# EAGLE design Mind-Synchronizing-Generator-PinHdrPotX-perf (EAGLE 7.2.0)
Analoger Wellenmustergenerator mit 3 (trippel-Fünf) 555 Timer.
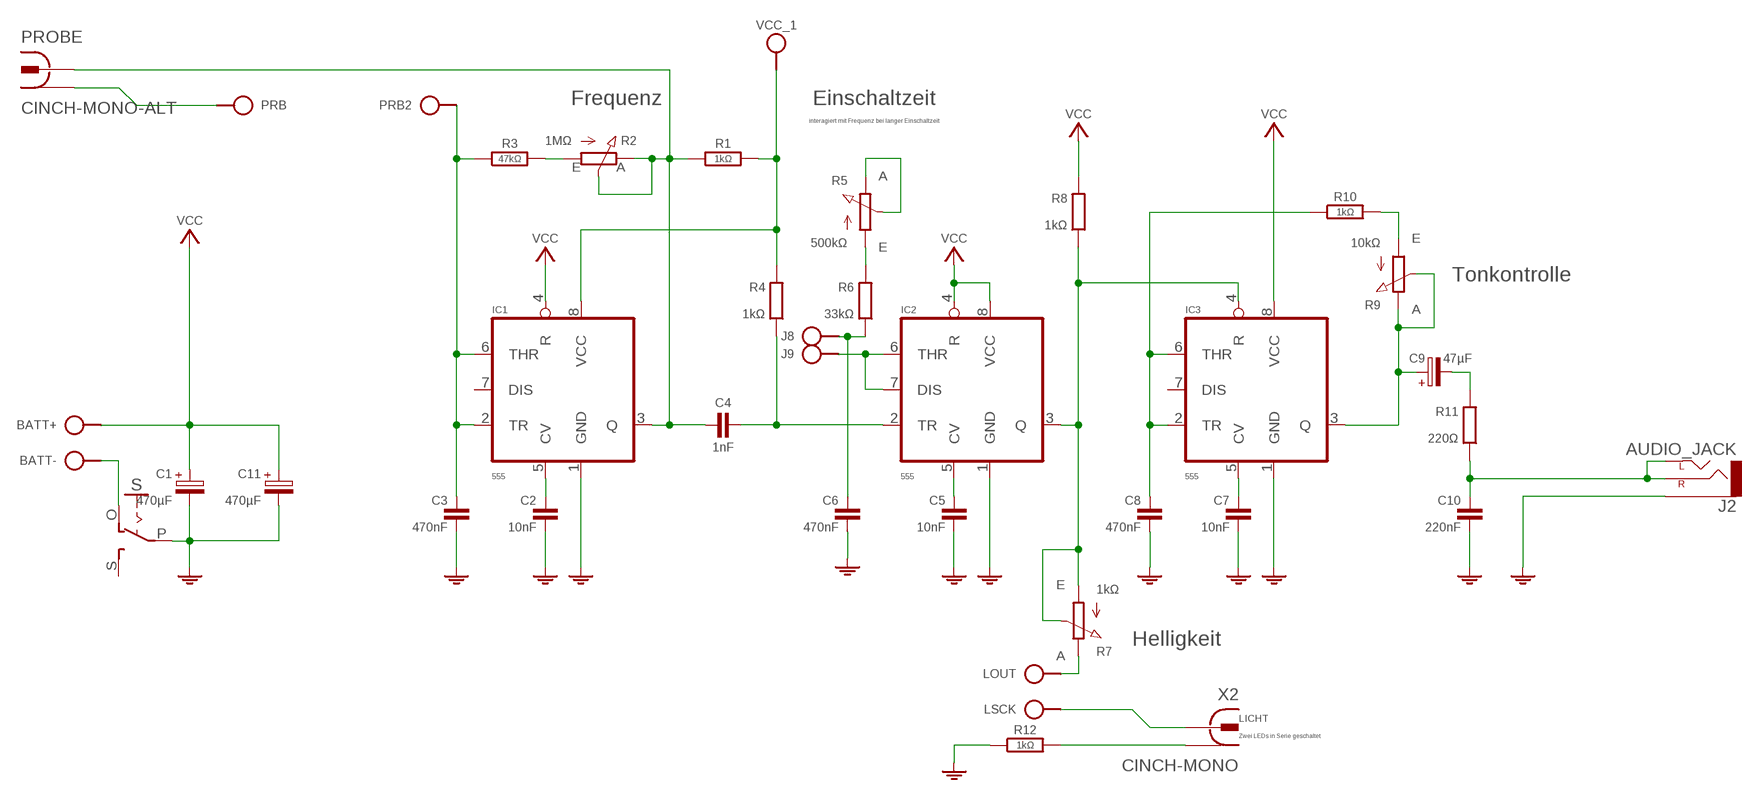
[diagram p0: schematic, sheet 1]

## Parts
BATT  SPAD+--+  [SPAD-+]
C1  470µF  CPOLE2.5-6  [E2,5-6]
C2  10nF  C050-020X044  [C050-020X044]
C3  470nF  C050-040X075  [C050-040X075]
C4  1nF  C-H050-020X044  [C050-020X044]
C5  10nF  C050-020X044/V  [C050-020X044/V]
C6  470nF  C050-040X075  [C050-040X075]
C7  10nF  C050-020X044/V  [C050-020X044/V]
C8  470nF  C050-040X075  [C050-040X075]
C9  47µF  CPOL-HE2,5-4  [E2,5-4]
C10  220nF  C025-025X060  [C050-025X060]
C11  470µF  CPOLE2.5-6  [E2,5-6]
IC1  555  555_ALT2-LBL  [555-DIL]
IC2  555  555_ALT2-LBL  [555-DIL]
IC3  555  555_ALT2-LBL  [555-DIL]
J2  AUDIO_JACK  [AUDIO-JACK]
J8  HPORT  [SPAD]
J9  HPORT  [SPAD]
LOUT  HPORT  [SPAD]
LSCK  HPORT  [SPAD]
PRB  HPORT  [SPAD]
PRB2  HPORT  [SPAD]
PROBE  CINCH-MONO-ALT  [736880-49]
R1  1kΩ  R-H0204/10  [0204/10]
R2  1MΩ  POT-H-3P  [CONN-3P]
R3  47kΩ  R-H0204/10  [0204/10]
R4  1kΩ  R0204/10-V  [0204/10-V]
R5  500kΩ  POT-3P  [CONN-3P]
R6  33kΩ  R0204/10  [0204/10]
R7  1kΩ  POT-3P-S1  [CONN-3P]
R8  1kΩ  R0204/10-V  [0204/10-V]
R9  10kΩ  POT-3P  [CONN-3P]
R10  1kΩ  R-H0204/10  [0204/10]
R11  220Ω  R0204/10-V  [0204/10-V]
R12  1kΩ  R-H0204/10  [0204/10]
S  SL-SW-1P-2T-H  [SLSW-1P2T-H]
VCC_1  VPORT  [SPAD]
X2  CINCH-MONO  [736880-49]

## Nets
GND: C1.- C2.2 C3.2 C5.2 C6.2 C7.2 C8.2 C10.2 C11.- IC1.1(GND) IC2.1(GND) IC3.1(GND) J2.SLEEVE R12.1 S.P
LED_A1: LOUT.1 R7.3(E)
LED_K: R12.2 X2.1
N$1: C5.1 IC2.5(CV)
N$2: BATT.1 S.O
N$4: LSCK.1 X2.1@1
N$5: C6.1 J8.1 R6.2
N$7: C2.1 IC1.5(CV)
N$8: R5.1(A) R6.1
N$10: R9.1(A) R10.2
N$11: R2.1(A) R3.2
N$15: C9.- R11.1
N$16: C10.1 J2.RING(RIGHT) J2.TIP(LEFT) R11.2
N$17: C7.1 IC3.5(CV)
PRB2: PRB.1 PROBE.1
Q1: C4.1 IC1.3(Q) PROBE.1@2 R1.1 R2.2(S) R2.3(E)
Q2: IC2.3(Q) IC3.4(R) R7.1(S) R7.2(A) R8.2
Q3: C9.+ IC3.3(Q) R9.2(S) R9.3(E)
TH2: IC2.6(THR) IC2.7(DIS) J9.1
TR1: C3.1 IC1.2(TR) IC1.6(THR) PRB2.1 R3.1
TR2: C4.2 IC2.2(TR) R4.2
TR3: C8.1 IC3.2(TR) IC3.6(THR) R10.1
VCC: BATT.2 C1.+ C11.+ IC1.4(R) IC2.4(R) IC2.8(VCC) IC3.8(VCC) R5.2(S) R5.3(E) R8.1
VCC_1: IC1.8(VCC) R1.2 R4.1 VCC_1.1
Unconnected: IC1.7(DIS) IC3.7(DIS) S.S

## Notes on the sheet
- Frequenz | Einschaltzeit
- interagiert mit Frequenz bei langer Einschaltzeit
- Tonkontrolle
- Helligkeit
- LICHT
- Zwei LEDs in Serie geschaltet

## Library data of the parts
BATT = pad:SPAD+-
C1 C11 = c:CPOL: POLARIZED CAPACITOR, European symbol
C2 C3 C5-C8 C10 = c:C: CAPACITOR, European symbol
C4 = c:C-H
C9 = c:CPOL-H
IC1-IC3 = ic:*555_ALT2
J2 = pad:AUDIO_JACK
J8 J9 LOUT LSCK PRB PRB2 = pad:HPORT
PROBE X2 = pad:CINCH-MONO: Lumberg Connectors include con-mfs.lbr - 2001.03.22 Jack connectors - 2005.11.23 http://www.lumberg.de Created by librarian@cadsoft.de
R1 R3 R10 R12 = r:R-H
R2 = r:POT-H
R4 R6 R8 R11 = r:R: RESISTOR, European symbol
R5 R7 R9 = r:POT
S = sw:SL-SW-1P-2T
VCC_1 = pad:VPORT

## Board
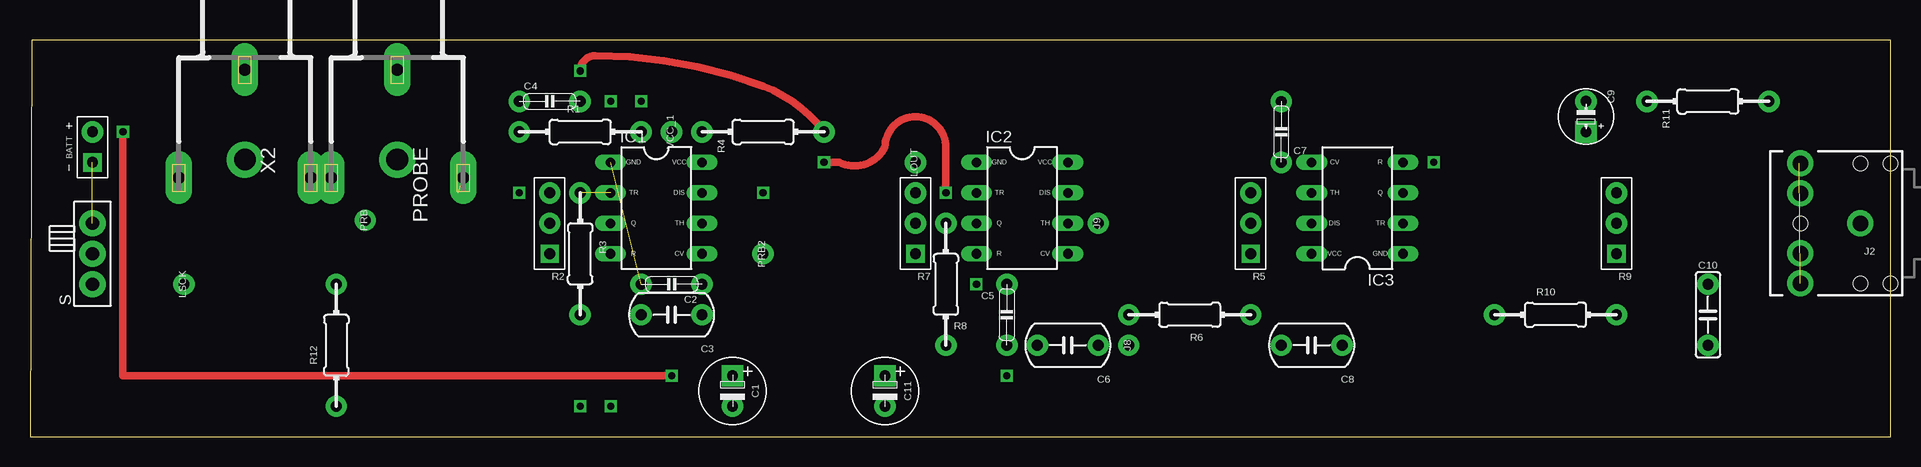
[diagram p1: board, top side]
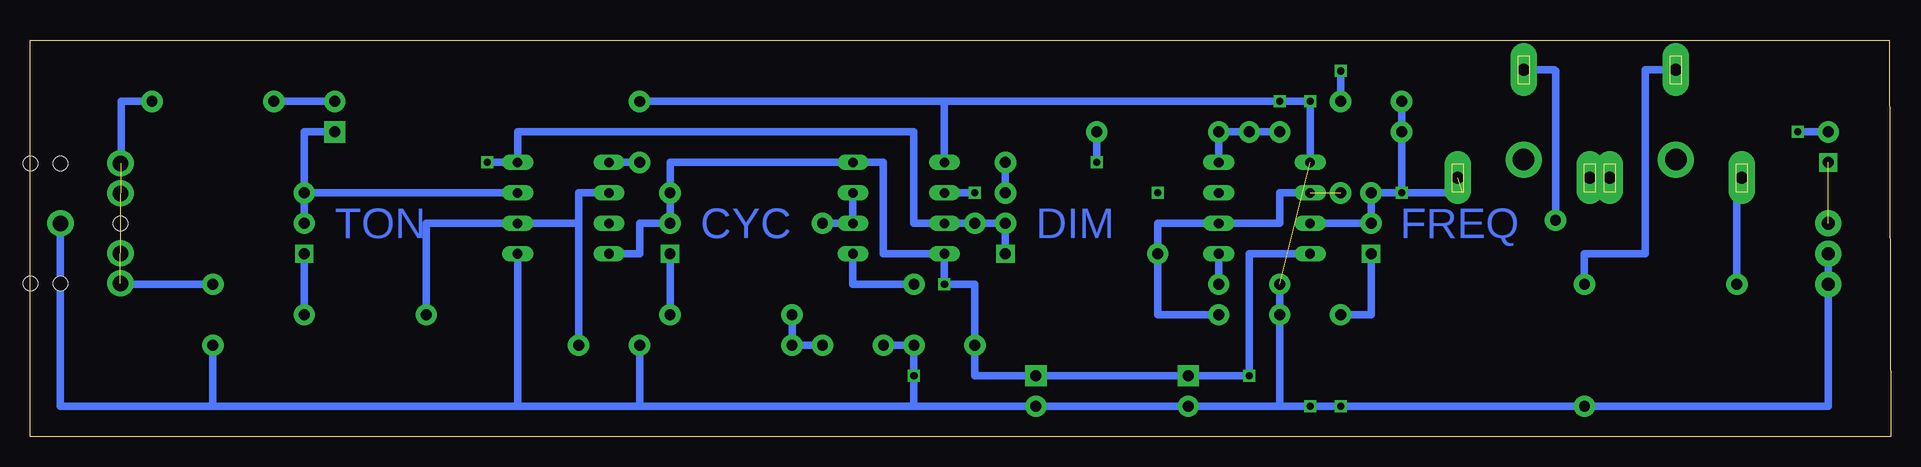
[diagram p2: board, bottom side, seen from below]

Size 155.07 x 33.02 mm. Coordinates in mm from the lower left corner, seen from the top.
Outline: 0,0 155.07,0 155.07,33.02 0.13,33.02 0,0
Copper layers (1*16): Top 0.035mm / dielectric 1.5mm / Bottom 0.035mm
Design rules "default": minimum track width 10mil, minimum drill 24mil, track to track 8mil, track to pad 8mil, pad to pad 8mil, via to via 8mil, smd to smd 8mil, copper to edge 40mil, drill to drill 8mil, minimum pad ring 10mil, minimum via ring 8mil, stop-mask expansion 4mil, vias tented up to drill 0mil, thermal gap 10mil

### Footprints (pad centres in the part's own frame; a part is rotated, then mirrored left to right if it is on the bottom)
SPAD-+ = drill 0.9 pad 1.524 square: 1 0,-1.27 | drill 0.9 pad 1.778: 2 0,1.27
E2,5-6 = drill 0.9 pad 1.778 square: + -1.27,0 | drill 0.9 pad 1.778: - 1.27,0
C050-020X044 = drill 0.9 pad 1.778: 1 -2.54,0; 2 2.54,0
C050-040X075 = drill 0.9 pad 1.778: 1 -2.54,0; 2 2.54,0
C050-020X044/V = drill 0.9 pad 1.778: 1 0,2.54; 2 0,-2.54
E2,5-4 = drill 0.9 pad 1.778 square: + 1.27,0 | drill 0.9 pad 1.778: - -1.27,0
C050-025X060 = drill 0.9 pad 1.778: 1 0,2.54; 2 0,-2.54
555-DIL = drill 0.8 pad 1.27 long: 1 -3.81,3.81; 2 -3.81,1.27; 3 -3.81,-1.27; 4 -3.81,-3.81; 5 3.81,-3.81; 6 3.81,-1.27; 7 3.81,1.27; 8 3.81,3.81
AUDIO-JACK = drill 1.3 pad 2.184: RING 5,5; RSH 5,2.5; SLEEVE 0,0; TIP 5,-5; TSH 5,-2.5 | hole 1.2: 0,5; -2.5,5; -2.5,-5; 0,-5; 5,0
SPAD = drill 0.9 pad 1.778: 1 0,0
736880-49 = drill 1 pad 2.2 long: 1 -3.92,0; 1@1 5.08,-5.5; 1@2 5.08,5.5 | drill 1.8 pad 3: 2 3.58,0
0204/10 = drill 0.9 pad 1.778: 1 -5.08,0; 2 5.08,0
CONN-3P = drill 0.9 pad 1.524 square: 1 0,2.54 | drill 0.9 pad 1.778: 2 0,0; 3 0,-2.54
0204/10-V = drill 0.9 pad 1.778: 1 0,5.08; 2 0,-5.08
SLSW-1P2T-H = drill 1.1 pad 2.184: O 2.54,0; P 0,0; S -2.54,0

### Placement (x,y rotation side)
BATT  5.21,24.13 0 top
C1  58.55,3.81 270 top
C2  53.47,12.7 180 top
C3  53.47,10.16 180 top
C4  43.31,27.94 0 top
C5  81.41,10.16 0 top
C6  86.49,7.62 180 top
C7  104.27,25.4 180 top
C8  106.81,7.62 180 top
C9  129.67,26.67 270 top
C10  139.83,10.16 0 top
C11  71.25,3.81 270 top
IC1  52.2,19.05 0 top
IC2  82.68,19.05 0 top
IC3  110.62,19.05 180 top
J2  152.53,17.78 180 top
J8  91.57,7.62 0 top
J9  89.03,17.78 0 top
LOUT  73.79,22.86 0 top
LSCK  12.83,12.7 0 top
PRB  27.94,18.03 0 top
PRB2  61.09,15.24 0 top
PROBE  30.61,26.67 270 top
R1  45.85,25.4 0 top
R2  43.31,17.78 180 top
R3  45.85,15.24 270 top
R4  61.09,25.4 90 top
R5  101.73,17.78 180 top
R6  96.65,10.16 180 top
R7  73.79,17.78 180 top
R8  76.33,12.7 180 top
R9  132.21,17.78 180 top
R10  127.13,10.16 0 top
R11  139.83,27.94 90 top
R12  25.53,7.62 90 top
S  5.21,15.24 90 top
VCC_1  53.47,25.4 0 top
X2  17.91,26.67 270 top

### Tracks (layer width: path | path; a pad name or v marks a point on that pad's centre or on a via)
GND  (via drill 0.6)  (1 unrouted)
  Bottom 0.61: C6.2 C5.2 v81.41,5.08 81.41,2.54 | 81.41,2.54 C11.- C1.- | C1.- v48.39,2.54 v45.85,2.54 R12.1 5.21,2.54 S.P | 78.87,27.94 C7.2 | IC2.1 78.87,27.94 | 78.87,27.94 v50.93,27.94 v48.39,27.94 IC1.1 | 104.27,2.54 81.41,2.54 | C8.2 104.27,2.54 | 104.27,2.54 114.43,2.54 | 114.43,2.54 IC3.1 | C2.2 C3.2 50.93,2.54 C1.- | 114.43,2.54 139.83,2.54 | 139.83,2.54 152.53,2.54 J2.SLEEVE | C10.2 139.83,2.54
LED_A1
  Bottom 0.61: R7.3 LOUT.1
LED_K
  Bottom 0.61: R12.2 25.53,15.24 20.45,15.24 20.45,30.59 X2.1
N$1
  Bottom 0.61: C5.1 86.49,12.7 IC2.5
N$2  (1 unrouted)
N$3  (via drill 0.6)
  other vias: 61.09,20.32
N$4
  Bottom 0.61: LSCK.1 12.83,21.59 X2.1@1
N$5
  Bottom 0.61: C6.1 J8.1 R6.2
N$7
  Bottom 0.61: C2.1 IC1.5
N$8
  Bottom 0.61: R5.1 R6.1
N$10
  Bottom 0.61: R9.1 R10.2
N$11
  Bottom 0.61: R3.2 43.31,10.16 R2.1
N$15
  Bottom 0.61: C9.- R11.1
N$16  (1 unrouted)
  Bottom 0.61: C10.1 147.53,12.7 J2.RING | 147.45,22.86 147.45,22.78 J2.TIP 147.45,22.86 | R11.2 147.45,27.94 147.45,22.86
N$17
  Bottom 0.61: C7.1 IC3.5
PRB2
  Bottom 0.61: PRB.1 27.94,30.48 28.07,30.48 28.07,30.59 PROBE.1
Q1  (via drill 0.6)  (1 unrouted)
  Bottom 0.61: v40.77,20.32 R2.3 R2.2 IC1.3 | v40.77,20.32 R1.1 C4.1 | v40.77,20.32 35.69,20.32
Q2  (via drill 0.6)
  Bottom 0.61: R7.1 R7.2 R8.2 IC2.3 81.41,17.78 81.41,25.4 114.43,25.4 IC3.4 v116.97,22.86
Q3
  Bottom 0.61: IC3.3 R9.3 | R9.3 R9.2 | R9.3 132.21,25.4 C9.+
TH2
  Bottom 0.61: IC2.7 IC2.6 J9.1
TR1  (1 unrouted)
  Bottom 0.61: C3.1 61.09,10.16 PRB2.1 61.09,17.78 IC1.6 50.93,17.78 50.93,20.32 IC1.2
TR2  (via drill 0.6)
  Top 0.61: v45.85,30.48 arc-90 47.12,31.75 arc-21 61.09,29.21 arc-33 R4.2 | v76.33,20.32 76.33,24.13 arc90 73.79,26.67 arc90 71.25,24.13 arc-90 67.44,22.86 v66.17,22.86
  Bottom 0.61: C4.2 v45.85,30.48 | R4.2 v66.17,22.86 | IC2.2 v76.33,20.32
TR3
  Bottom 0.61: IC3.6 109.35,20.32 109.35,17.78 | 109.35,17.78 C8.1 | 109.35,17.78 IC3.2 122.05,17.78 R10.1
VCC  (via drill 0.6)
  Top 0.61: v7.75,25.4 7.75,5.08 v53.47,5.08
  Bottom 0.61: IC1.4 53.47,15.24 v53.47,5.08 C1.+ C11.+ 76.33,5.08 R8.1 76.33,12.7 v78.87,12.7 IC2.4 83.95,15.24 83.95,22.86 IC2.8 101.73,22.86 R5.3 R5.2 104.27,17.78 104.27,15.24 IC3.8 | v7.75,25.4 BATT.2
VCC_1
  Bottom 0.61: R1.2 VCC_1.1 R4.1 IC1.8

### Text on the board
Bottom: FREQ | DIM | CYC | TON
Measures: 5 | 4 | 3 | 2 | 1 | 5 | 4 | 3 | 2 | 1 | 5 | 4 | 3 | 2 | 1